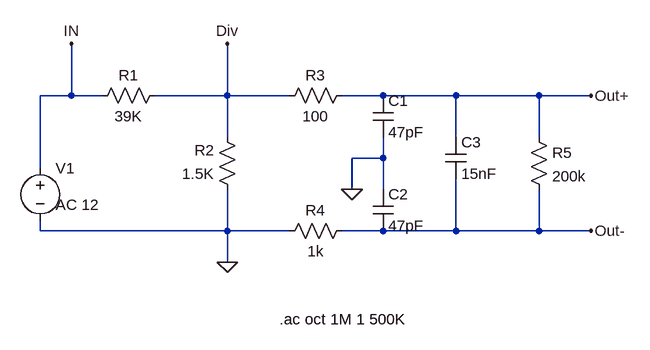
[diagram p0: schematic ohm_frontend.asc]
ohm_frontend.asc, the LTspice schematic file:
Version 4
SHEET 1 880 680
WIRE -1696 112 -1696 32
WIRE -1696 112 -1744 112
WIRE -1648 112 -1696 112
WIRE -1456 112 -1456 32
WIRE -1456 112 -1568 112
WIRE -1360 112 -1456 112
WIRE -1216 112 -1280 112
WIRE -1104 112 -1216 112
WIRE -976 112 -1104 112
WIRE -896 112 -976 112
WIRE -1456 176 -1456 112
WIRE -1104 176 -1104 112
WIRE -976 176 -976 112
WIRE -1216 208 -1216 176
WIRE -1216 208 -1264 208
WIRE -1744 224 -1744 112
WIRE -1264 256 -1264 208
WIRE -1216 256 -1216 208
WIRE -1744 320 -1744 304
WIRE -1456 320 -1456 256
WIRE -1456 320 -1744 320
WIRE -1360 320 -1456 320
WIRE -1216 320 -1280 320
WIRE -1104 320 -1104 240
WIRE -1104 320 -1216 320
WIRE -976 320 -976 256
WIRE -976 320 -1104 320
WIRE -896 320 -976 320
WIRE -1456 368 -1456 320
FLAG -1456 368 0
FLAG -1264 256 0
FLAG -1696 32 IN
FLAG -896 112 Out+
FLAG -896 320 Out-
FLAG -1456 32 Div
SYMBOL res -1552 96 R90
WINDOW 0 0 56 VBottom 2
WINDOW 3 32 56 VTop 2
SYMATTR InstName R1
SYMATTR Value 39K
SYMBOL res -1440 272 R180
WINDOW 0 36 76 Left 2
WINDOW 3 36 40 Left 2
SYMATTR InstName R2
SYMATTR Value 1.5K
SYMBOL res -1376 128 R270
WINDOW 0 32 56 VTop 2
WINDOW 3 0 56 VBottom 2
SYMATTR InstName R3
SYMATTR Value 100
SYMBOL res -1376 336 R270
WINDOW 0 32 56 VTop 2
WINDOW 3 0 56 VBottom 2
SYMATTR InstName R4
SYMATTR Value 1k
SYMBOL cap -1232 112 R0
SYMATTR InstName C1
SYMATTR Value 47pF
SYMBOL cap -1232 256 R0
SYMATTR InstName C2
SYMATTR Value 47pF
SYMBOL cap -1120 176 R0
SYMATTR InstName C3
SYMATTR Value 15nF
SYMBOL res -992 160 R0
SYMATTR InstName R5
SYMATTR Value 200k
SYMBOL voltage -1744 208 R0
WINDOW 3 24 44 Left 2
WINDOW 123 24 72 Left 2
WINDOW 39 0 0 Left 2
SYMATTR InstName V1
SYMATTR Value ""
SYMATTR Value2 AC 12
TEXT -1376 456 Left 2 !.ac oct 1M 1 500K

The netlist it stands for:
* ohm_frontend.asc
R1 Div IN 39K
R2 0 Div 1.5K
R3 Div Out+ 100
R4 0 Out- 1k
C1 Out+ 0 47pF
C2 0 Out- 47pF
C3 Out+ Out- 15nF
R5 Out+ Out- 200k
V1 IN 0 AC 12
.ac oct 1M 1 500K
.backanno
.end